# EAGLE design ECLOCK01 (EAGLE 7.3.0)

## Sheet 1 of 2
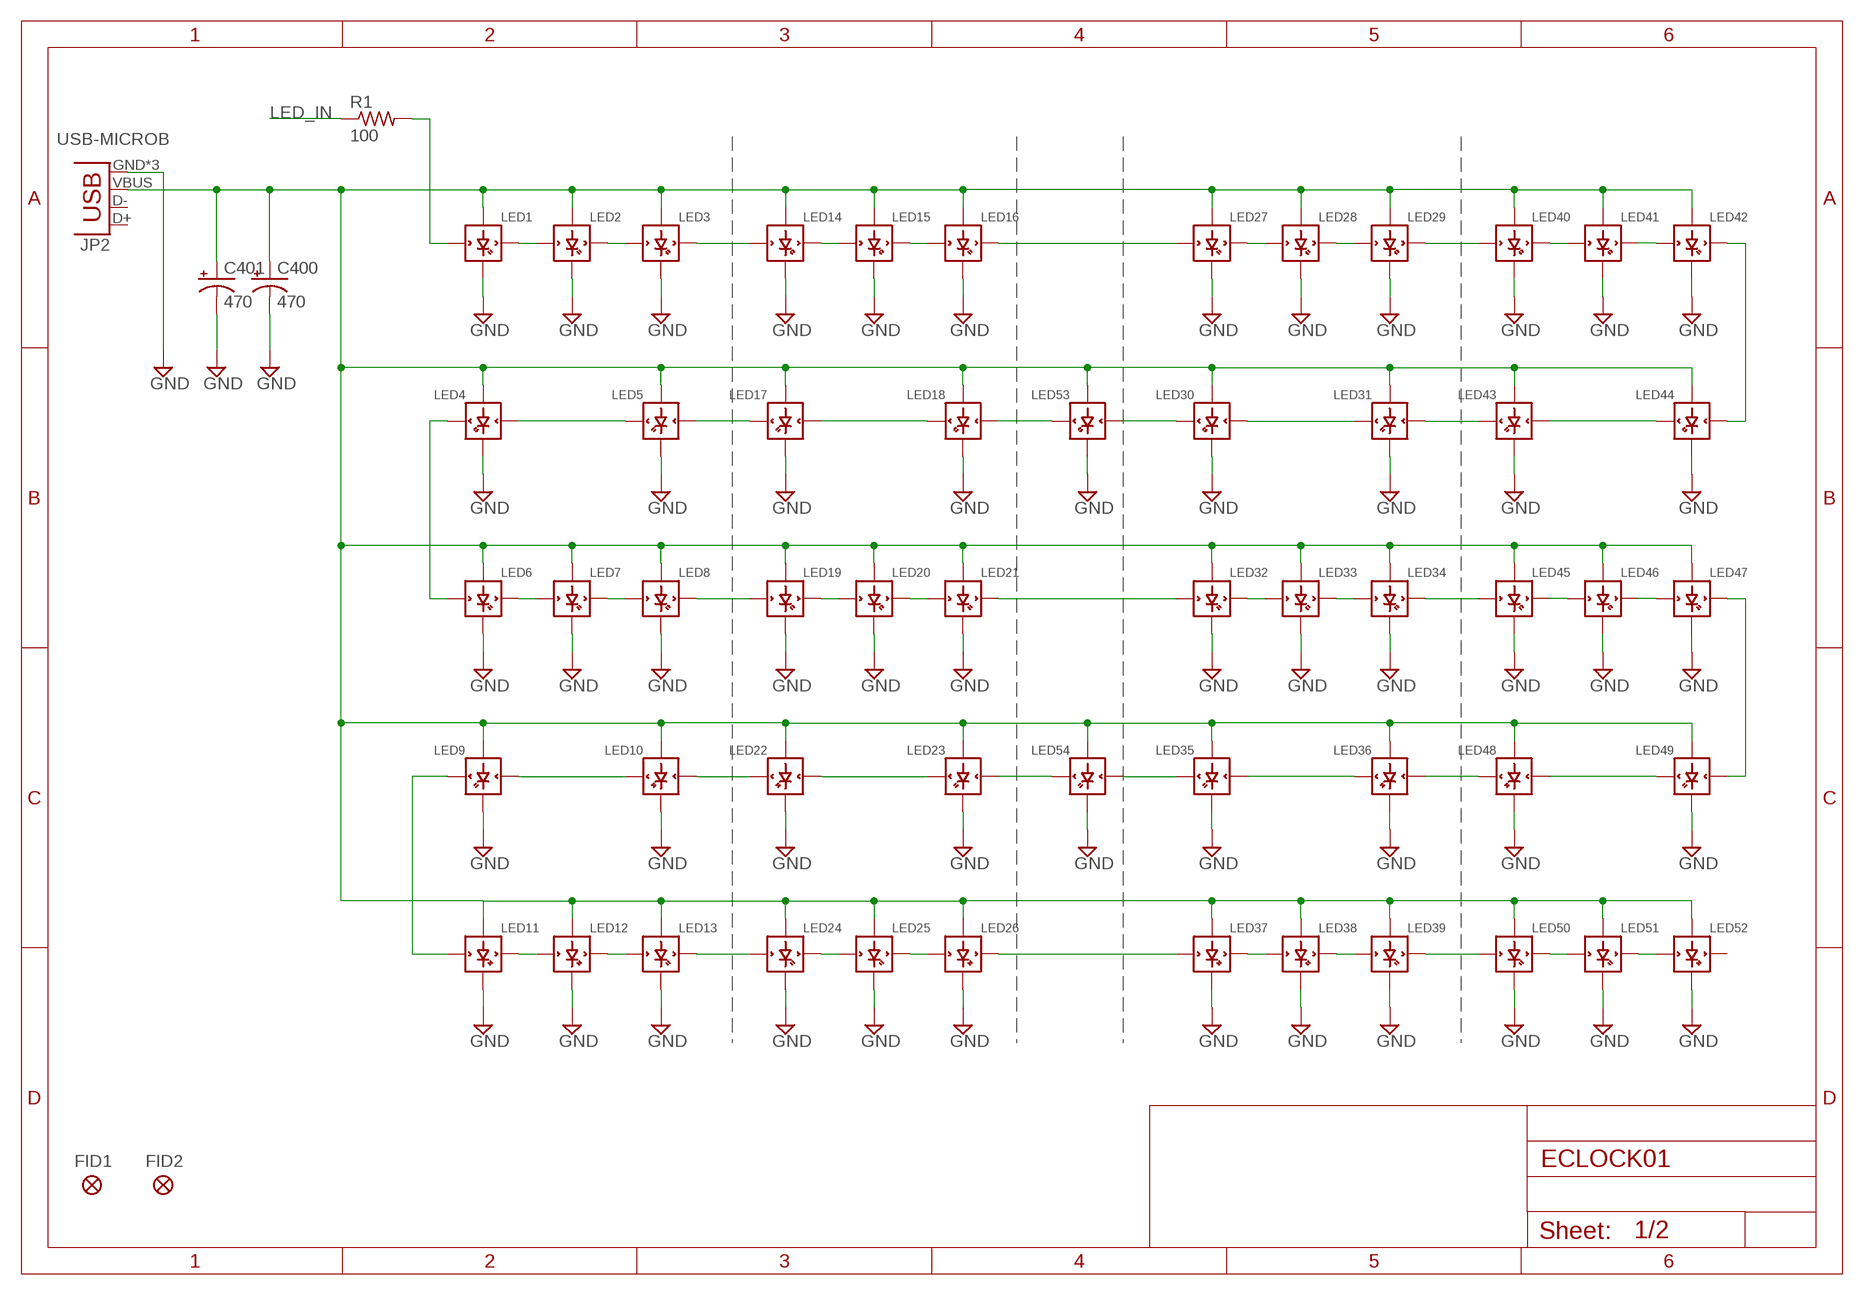
[diagram p0: schematic, sheet 1]

### Parts
C400  470  CPOL-USE  [PANASONIC_E]
C401  470  CPOL-USE  [PANASONIC_E]
FID1  FIDUCIAL  [FIDUCIAL]
FID2  FIDUCIAL  [FIDUCIAL]
JP2  USB-MICROB  [USB-MICROB]
LED1  WS2812B  [WS2812B]
LED2  WS2812B  [WS2812B]
LED3  WS2812B  [WS2812B]
LED4  WS2812B  [WS2812B]
LED5  WS2812B  [WS2812B]
LED6  WS2812B  [WS2812B]
LED7  WS2812B  [WS2812B]
LED8  WS2812B  [WS2812B]
LED9  WS2812B  [WS2812B]
LED10  WS2812B  [WS2812B]
LED11  WS2812B  [WS2812B]
LED12  WS2812B  [WS2812B]
LED13  WS2812B  [WS2812B]
LED14  WS2812B  [WS2812B]
LED15  WS2812B  [WS2812B]
LED16  WS2812B  [WS2812B]
LED17  WS2812B  [WS2812B]
LED18  WS2812B  [WS2812B]
LED19  WS2812B  [WS2812B]
LED20  WS2812B  [WS2812B]
LED21  WS2812B  [WS2812B]
LED22  WS2812B  [WS2812B]
LED23  WS2812B  [WS2812B]
LED24  WS2812B  [WS2812B]
LED25  WS2812B  [WS2812B]
LED26  WS2812B  [WS2812B]
LED27  WS2812B  [WS2812B]
LED28  WS2812B  [WS2812B]
LED29  WS2812B  [WS2812B]
LED30  WS2812B  [WS2812B]
LED31  WS2812B  [WS2812B]
LED32  WS2812B  [WS2812B]
LED33  WS2812B  [WS2812B]
LED34  WS2812B  [WS2812B]
LED35  WS2812B  [WS2812B]
LED36  WS2812B  [WS2812B]
LED37  WS2812B  [WS2812B]
LED38  WS2812B  [WS2812B]
LED39  WS2812B  [WS2812B]
LED40  WS2812B  [WS2812B]
LED41  WS2812B  [WS2812B]
LED42  WS2812B  [WS2812B]
LED43  WS2812B  [WS2812B]
LED44  WS2812B  [WS2812B]
LED45  WS2812B  [WS2812B]
LED46  WS2812B  [WS2812B]
LED47  WS2812B  [WS2812B]
LED48  WS2812B  [WS2812B]
LED49  WS2812B  [WS2812B]
LED50  WS2812B  [WS2812B]
LED51  WS2812B  [WS2812B]
LED52  WS2812B  [WS2812B]
LED53  WS2812B  [WS2812B]
LED54  WS2812B  [WS2812B]
R1  100  RESISTOR0805  [0805]

### Nets
GND: C400.- C401.- JP2.GND JP2.MT1(GND) JP2.MT2(GND) LED1.3-GND(GND) LED2.3-GND(GND) LED3.3-GND(GND) LED4.3-GND(GND) LED5.3-GND(GND) LED6.3-GND(GND) LED7.3-GND(GND) LED8.3-GND(GND) LED9.3-GND(GND) LED10.3-GND(GND) LED11.3-GND(GND) LED12.3-GND(GND) LED13.3-GND(GND) LED14.3-GND(GND) LED15.3-GND(GND) LED16.3-GND(GND) LED17.3-GND(GND) LED18.3-GND(GND) LED19.3-GND(GND) LED20.3-GND(GND) LED21.3-GND(GND) LED22.3-GND(GND) LED23.3-GND(GND) LED24.3-GND(GND) LED25.3-GND(GND) LED26.3-GND(GND) LED27.3-GND(GND) LED28.3-GND(GND) LED29.3-GND(GND) LED30.3-GND(GND) LED31.3-GND(GND) LED32.3-GND(GND) LED33.3-GND(GND) LED34.3-GND(GND) LED35.3-GND(GND) LED36.3-GND(GND) LED37.3-GND(GND) LED38.3-GND(GND) LED39.3-GND(GND) LED40.3-GND(GND) LED41.3-GND(GND) LED42.3-GND(GND) LED43.3-GND(GND) LED44.3-GND(GND) LED45.3-GND(GND) LED46.3-GND(GND) LED47.3-GND(GND) LED48.3-GND(GND) LED49.3-GND(GND) LED50.3-GND(GND) LED51.3-GND(GND) LED52.3-GND(GND) LED53.3-GND(GND) LED54.3-GND(GND) ; also sheet 2
LED_IN: R1.1 ; also sheet 2
N$1: LED1.4-DIN(DIN) R1.2
N$2: LED11.2-DOUT(DOUT) LED12.4-DIN(DIN)
N$3: LED1.2-DOUT(DOUT) LED2.4-DIN(DIN)
N$4: LED2.2-DOUT(DOUT) LED3.4-DIN(DIN)
N$5: LED16.2-DOUT(DOUT) LED27.4-DIN(DIN)
N$7: LED12.2-DOUT(DOUT) LED13.4-DIN(DIN)
N$8: LED26.2-DOUT(DOUT) LED37.4-DIN(DIN)
N$9: LED14.2-DOUT(DOUT) LED15.4-DIN(DIN)
N$10: LED15.2-DOUT(DOUT) LED16.4-DIN(DIN)
N$12: LED18.4-DIN(DIN) LED53.2-DOUT(DOUT)
N$13: LED19.2-DOUT(DOUT) LED20.4-DIN(DIN)
N$14: LED17.4-DIN(DIN) LED18.2-DOUT(DOUT)
N$15: LED8.2-DOUT(DOUT) LED19.4-DIN(DIN)
N$16: LED47.2-DOUT(DOUT) LED49.4-DIN(DIN)
N$17: LED39.2-DOUT(DOUT) LED50.4-DIN(DIN)
N$18: LED24.2-DOUT(DOUT) LED25.4-DIN(DIN)
N$19: LED25.2-DOUT(DOUT) LED26.4-DIN(DIN)
N$20: LED13.2-DOUT(DOUT) LED24.4-DIN(DIN)
N$21: LED27.2-DOUT(DOUT) LED28.4-DIN(DIN)
N$22: LED28.2-DOUT(DOUT) LED29.4-DIN(DIN)
N$25: LED40.2-DOUT(DOUT) LED41.4-DIN(DIN)
N$26: LED20.2-DOUT(DOUT) LED21.4-DIN(DIN)
N$27: LED9.2-DOUT(DOUT) LED11.4-DIN(DIN)
N$28: LED5.4-DIN(DIN) LED17.2-DOUT(DOUT)
N$29: LED4.4-DIN(DIN) LED5.2-DOUT(DOUT)
N$30: LED6.2-DOUT(DOUT) LED7.4-DIN(DIN)
N$31: LED7.2-DOUT(DOUT) LED8.4-DIN(DIN)
N$32: LED21.2-DOUT(DOUT) LED32.4-DIN(DIN)
N$33: LED48.4-DIN(DIN) LED49.2-DOUT(DOUT)
N$34: LED36.4-DIN(DIN) LED48.2-DOUT(DOUT)
N$36: LED37.2-DOUT(DOUT) LED38.4-DIN(DIN)
N$37: LED38.2-DOUT(DOUT) LED39.4-DIN(DIN)
N$39: LED30.2-DOUT(DOUT) LED53.4-DIN(DIN)
N$40: LED34.2-DOUT(DOUT) LED45.4-DIN(DIN)
N$41: LED32.2-DOUT(DOUT) LED33.4-DIN(DIN)
N$42: LED33.2-DOUT(DOUT) LED34.4-DIN(DIN)
N$44: LED31.4-DIN(DIN) LED43.2-DOUT(DOUT)
N$45: LED4.2-DOUT(DOUT) LED6.4-DIN(DIN)
N$46: LED46.2-DOUT(DOUT) LED47.4-DIN(DIN)
N$47: LED45.2-DOUT(DOUT) LED46.4-DIN(DIN)
N$48: LED42.2-DOUT(DOUT) LED44.4-DIN(DIN)
N$49: LED43.4-DIN(DIN) LED44.2-DOUT(DOUT)
N$50: LED30.4-DIN(DIN) LED31.2-DOUT(DOUT)
N$51: LED41.2-DOUT(DOUT) LED42.4-DIN(DIN)
N$52: LED35.4-DIN(DIN) LED36.2-DOUT(DOUT)
N$53: LED35.2-DOUT(DOUT) LED54.4-DIN(DIN)
N$54: LED50.2-DOUT(DOUT) LED51.4-DIN(DIN)
N$55: LED51.2-DOUT(DOUT) LED52.4-DIN(DIN)
N$56: LED23.4-DIN(DIN) LED54.2-DOUT(DOUT)
N$58: LED22.4-DIN(DIN) LED23.2-DOUT(DOUT)
N$59: LED3.2-DOUT(DOUT) LED14.4-DIN(DIN)
N$60: LED10.4-DIN(DIN) LED22.2-DOUT(DOUT)
N$61: LED9.4-DIN(DIN) LED10.2-DOUT(DOUT)
N$62: LED29.2-DOUT(DOUT) LED40.4-DIN(DIN)
VDD: C400.+ C401.+ JP2.VBUS LED1.1-VDD(VDD) LED2.1-VDD(VDD) LED3.1-VDD(VDD) LED4.1-VDD(VDD) LED5.1-VDD(VDD) LED6.1-VDD(VDD) LED7.1-VDD(VDD) LED8.1-VDD(VDD) LED9.1-VDD(VDD) LED10.1-VDD(VDD) LED11.1-VDD(VDD) LED12.1-VDD(VDD) LED13.1-VDD(VDD) LED14.1-VDD(VDD) LED15.1-VDD(VDD) LED16.1-VDD(VDD) LED17.1-VDD(VDD) LED18.1-VDD(VDD) LED19.1-VDD(VDD) LED20.1-VDD(VDD) LED21.1-VDD(VDD) LED22.1-VDD(VDD) LED23.1-VDD(VDD) LED24.1-VDD(VDD) LED25.1-VDD(VDD) LED26.1-VDD(VDD) LED27.1-VDD(VDD) LED28.1-VDD(VDD) LED29.1-VDD(VDD) LED30.1-VDD(VDD) LED31.1-VDD(VDD) LED32.1-VDD(VDD) LED33.1-VDD(VDD) LED34.1-VDD(VDD) LED35.1-VDD(VDD) LED36.1-VDD(VDD) LED37.1-VDD(VDD) LED38.1-VDD(VDD) LED39.1-VDD(VDD) LED40.1-VDD(VDD) LED41.1-VDD(VDD) LED42.1-VDD(VDD) LED43.1-VDD(VDD) LED44.1-VDD(VDD) LED45.1-VDD(VDD) LED46.1-VDD(VDD) LED47.1-VDD(VDD) LED48.1-VDD(VDD) LED49.1-VDD(VDD) LED50.1-VDD(VDD) LED51.1-VDD(VDD) LED52.1-VDD(VDD) LED53.1-VDD(VDD) LED54.1-VDD(VDD) ; also sheet 2
Unconnected: JP2.D+ JP2.D- LED52.2-DOUT(DOUT)

## Sheet 2 of 2
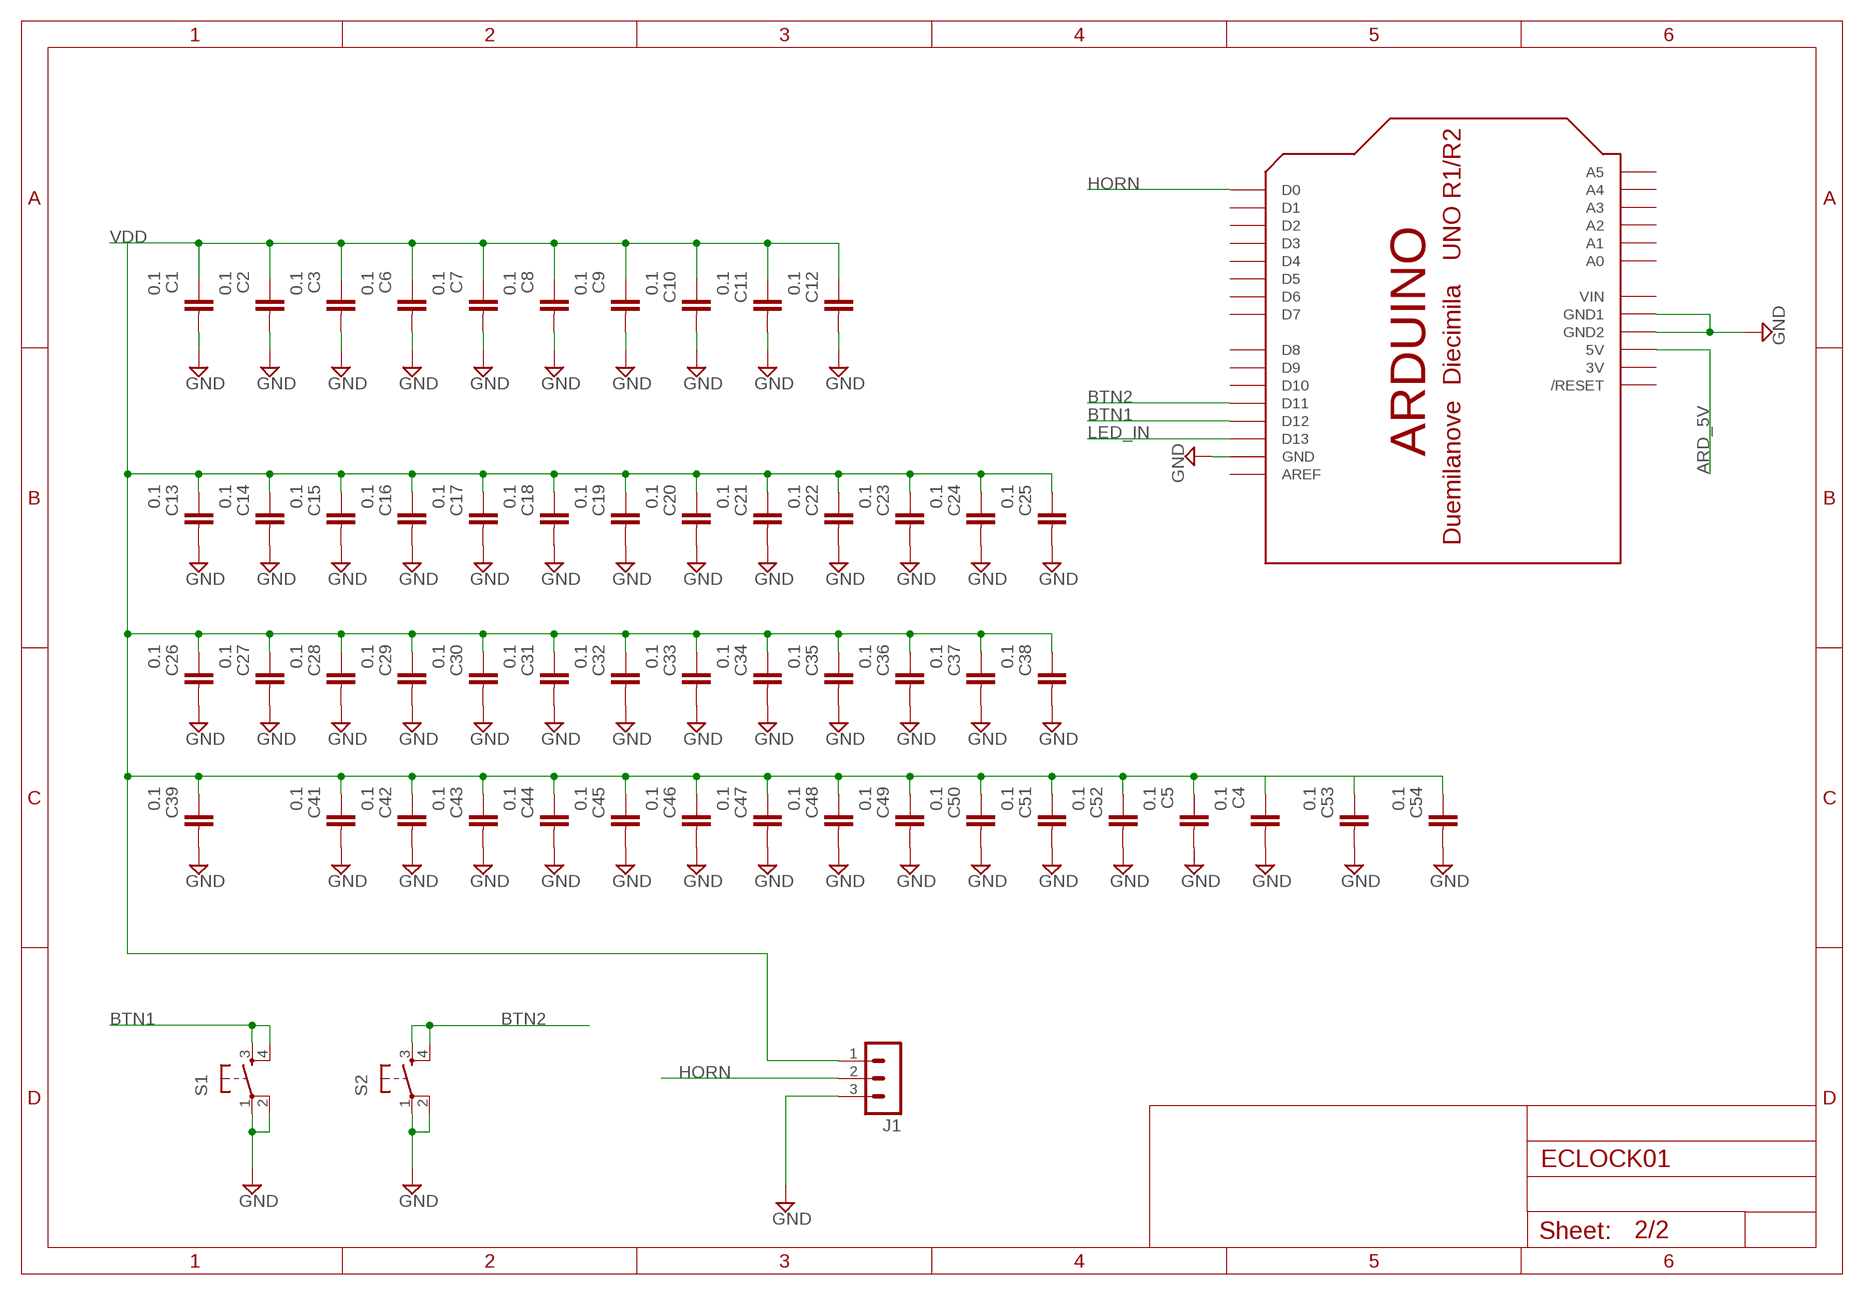
[diagram p1: schematic, sheet 2]

### Parts
C1  0.1  CAPACITOR0805  [0805]
C2  0.1  CAPACITOR0805  [0805]
C3  0.1  CAPACITOR0805  [0805]
C4  0.1  CAPACITOR0805  [0805]
C5  0.1  CAPACITOR0805  [0805]
C6  0.1  CAPACITOR0805  [0805]
C7  0.1  CAPACITOR0805  [0805]
C8  0.1  CAPACITOR0805  [0805]
C9  0.1  CAPACITOR0805  [0805]
C10  0.1  CAPACITOR0805  [0805]
C11  0.1  CAPACITOR0805  [0805]
C12  0.1  CAPACITOR0805  [0805]
C13  0.1  CAPACITOR0805  [0805]
C14  0.1  CAPACITOR0805  [0805]
C15  0.1  CAPACITOR0805  [0805]
C16  0.1  CAPACITOR0805  [0805]
C17  0.1  CAPACITOR0805  [0805]
C18  0.1  CAPACITOR0805  [0805]
C19  0.1  CAPACITOR0805  [0805]
C20  0.1  CAPACITOR0805  [0805]
C21  0.1  CAPACITOR0805  [0805]
C22  0.1  CAPACITOR0805  [0805]
C23  0.1  CAPACITOR0805  [0805]
C24  0.1  CAPACITOR0805  [0805]
C25  0.1  CAPACITOR0805  [0805]
C26  0.1  CAPACITOR0805  [0805]
C27  0.1  CAPACITOR0805  [0805]
C28  0.1  CAPACITOR0805  [0805]
C29  0.1  CAPACITOR0805  [0805]
C30  0.1  CAPACITOR0805  [0805]
C31  0.1  CAPACITOR0805  [0805]
C32  0.1  CAPACITOR0805  [0805]
C33  0.1  CAPACITOR0805  [0805]
C34  0.1  CAPACITOR0805  [0805]
C35  0.1  CAPACITOR0805  [0805]
C36  0.1  CAPACITOR0805  [0805]
C37  0.1  CAPACITOR0805  [0805]
C38  0.1  CAPACITOR0805  [0805]
C39  0.1  CAPACITOR0805  [0805]
C41  0.1  CAPACITOR0805  [0805]
C42  0.1  CAPACITOR0805  [0805]
C43  0.1  CAPACITOR0805  [0805]
C44  0.1  CAPACITOR0805  [0805]
C45  0.1  CAPACITOR0805  [0805]
C46  0.1  CAPACITOR0805  [0805]
C47  0.1  CAPACITOR0805  [0805]
C48  0.1  CAPACITOR0805  [0805]
C49  0.1  CAPACITOR0805  [0805]
C50  0.1  CAPACITOR0805  [0805]
C51  0.1  CAPACITOR0805  [0805]
C52  0.1  CAPACITOR0805  [0805]
C53  0.1  CAPACITOR0805  [0805]
C54  0.1  CAPACITOR0805  [0805]
J1  MA03-1  [MA03-1]
S1  TAC_SWITCHSMD  [TACTILE_SWITCH_SMD]
S2  TAC_SWITCHSMD  [TACTILE_SWITCH_SMD]
U$1  ARDUINOUNO  [ARDUINO-UNO]

### Nets
ARD_5V: U$1.5V
BTN1: S1.3 S1.4 U$1.D12
BTN2: S2.3 S2.4 U$1.D11
GND: C1.2 C2.2 C3.2 C4.2 C5.2 C6.2 C7.2 C8.2 C9.2 C10.2 C11.2 C12.2 C13.2 C14.2 C15.2 C16.2 C17.2 C18.2 C19.2 C20.2 C21.2 C22.2 C23.2 C24.2 C25.2 C26.2 C27.2 C28.2 C29.2 C30.2 C31.2 C32.2 C33.2 C34.2 C35.2 C36.2 C37.2 C38.2 C39.2 C41.2 C42.2 C43.2 C44.2 C45.2 C46.2 C47.2 C48.2 C49.2 C50.2 C51.2 C52.2 C53.2 C54.2 J1.3 S1.1 S1.2 S2.1 S2.2 U$1.GND U$1.GND1 U$1.GND2 ; also sheet 1
HORN: J1.2 U$1.D0
LED_IN: U$1.D13 ; also sheet 1
VDD: C1.1 C2.1 C3.1 C4.1 C5.1 C6.1 C7.1 C8.1 C9.1 C10.1 C11.1 C12.1 C13.1 C14.1 C15.1 C16.1 C17.1 C18.1 C19.1 C20.1 C21.1 C22.1 C23.1 C24.1 C25.1 C26.1 C27.1 C28.1 C29.1 C30.1 C31.1 C32.1 C33.1 C34.1 C35.1 C36.1 C37.1 C38.1 C39.1 C41.1 C42.1 C43.1 C44.1 C45.1 C46.1 C47.1 C48.1 C49.1 C50.1 C51.1 C52.1 C53.1 C54.1 J1.1 ; also sheet 1
Unconnected: U$1.A0 U$1.A1 U$1.A2 U$1.A3 U$1.A4 U$1.A5 U$1.AREF U$1.D1 U$1.D2 U$1.D3 U$1.D4 U$1.D5 U$1.D6 U$1.D7 U$1.D8 U$1.D9 U$1.D10 U$1.RESET(/RESET)

## Power pins joined to a net without a drawn wire
3V: U$1.3V
VIN: U$1.VIN

## Library data of the parts
C1-C39 C41-C54 = TinWhiskers:CAPACITOR
C400 C401 = adafruit:CPOL-US: POLARIZED CAPACITOR, American symbol
FID1 FID2 = TinWhiskers:FIDUCIAL
J1 = !con-lstb:MA03-1: PIN HEADER
JP2 = SparkFun-Connectors:USB: USB Connectors USB-B-PTH is fully proven SKU : PRT-00139/CONN-08278 USB-miniB is fully proven SKU : PRT-00587 USB-A-PCB is untested. USB-A-H is throughly reviewed, but untested. Spark Fun Electronics SKU : PRT-00437 USB-B-SMT is throughly reviewed, but untested. Needs silkscreen touching up. USB-A-S has not been used/tested USB-MB-H has not been used/tested USB-MICROB has been used. CONN-09505; PROD_ID: CONN-09505
LED1-LED54 = GinWhiskers - temp stuff:WS2812B
R1 = TinWhiskers:RESISTOR
S1 S2 = SparkFun:TAC_SWITCH: Momentary Switch Button commonly used for reset or general input. Spark Fun Electronics SKU : COM-00097
U$1 = GinWhiskers - temp stuff:ARDUINO

## Net classes
0 default: width 0.152 mm, drill 0.305 mm, clearance 0.152 mm

## Board
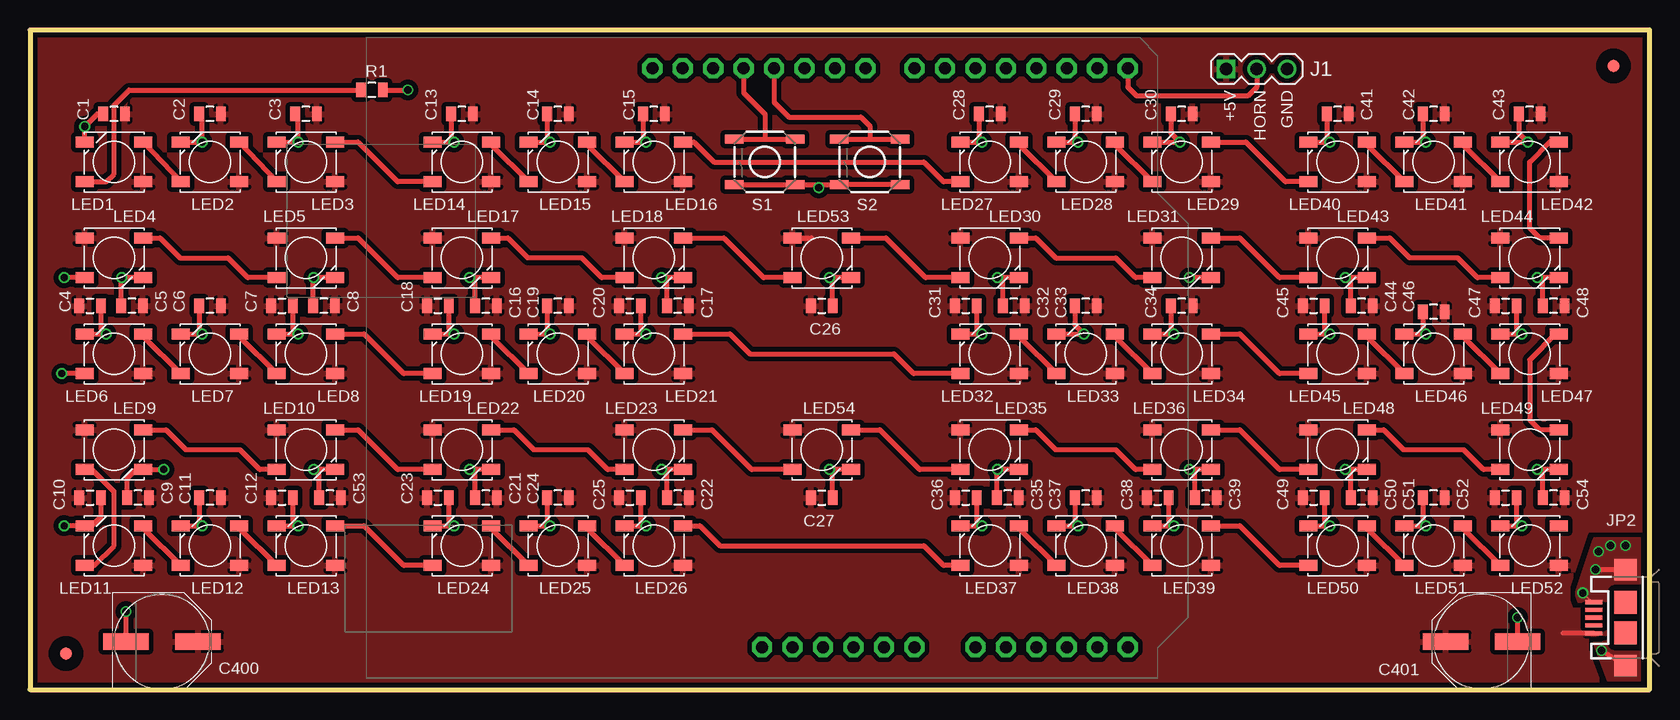
[diagram p2: board, top side]
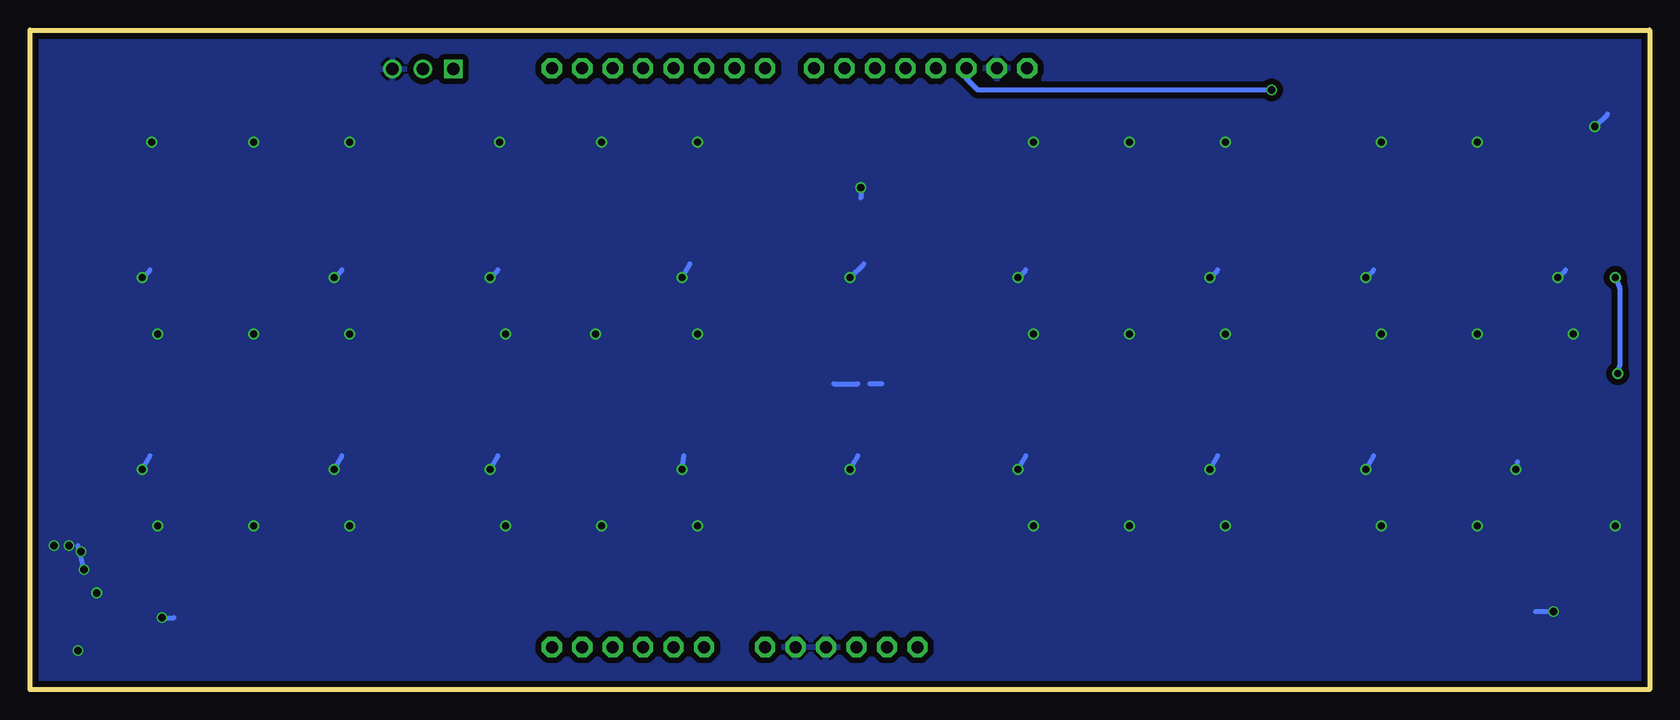
[diagram p3: board, bottom side, seen from below]

Size 135 x 55 mm. Coordinates in mm from the lower left corner, seen from the top.
Outline: 0,0 135,0 135,55 0,55 0,0
Copper layers (1*16): Top 0.035mm / dielectric 1.5mm / Bottom 0.035mm
Design rules "SeeedStudio_2layer_DRU_no_angle_20140221": minimum track width 6mil, minimum drill 12mil, track to track 6mil, track to pad 6mil, pad to pad 6mil, via to via 6mil, smd to smd 0mil, copper to edge 10mil, drill to drill 10mil, minimum pad ring 10mil, minimum via ring 6mil, stop-mask expansion 2mil, vias tented up to drill 100mil, thermal gap 10mil

### Footprints (pad centres in the part's own frame; a part is rotated, then mirrored left to right if it is on the bottom)
0805 = smd 0.8 x 1.2: 1 -0.9,0; 2 0.9,0
PANASONIC_E = smd 3.8 x 1.4: + 3,0; - -3,0
FIDUCIAL = smd 1 x 1: 1 0,0
MA03-1 = drill 1.016 square: 1 -2.54,0 | drill 1.016: 2 0,0; 3 2.54,0
USB-MICROB = smd 0.35 x 1.4: D+ 0,2.65; D- -0.65,2.65; GND 1.3,2.65; ID 0.65,2.65; VBUS -1.3,2.65 | smd 1.8 x 1.9: MT1 -4,0; MT2 4,0 | smd 1.9 x 1.9: P$1 -1.27,0; P$2 1.27,0
WS2812B = smd 1.5 x 0.9: 1-VDD 2.45,-1.65; 2-DOUT 2.45,1.65; 3-GND -2.45,1.65; 4-DIN -2.45,-1.65
TACTILE_SWITCH_SMD = smd 1.524 x 0.762: 1 -2.54,1.905; 2 2.54,1.905; 3 -2.54,-1.905; 4 2.54,-1.905
ARDUINO-UNO = drill 1 pad 1.676 octagon: 3V 35.56,2.54; 5V 38.1,2.54; A0 50.8,2.54; A1 53.34,2.54; A2 55.88,2.54; A3 58.42,2.54; A4 60.96,2.54; A5 63.5,2.54; AREF 23.876,50.8; D0 63.5,50.8; D1 60.96,50.8; D2 58.42,50.8; D3 55.88,50.8; D4 53.34,50.8; D5 50.8,50.8; D6 48.26,50.8; D7 45.72,50.8; D8 41.656,50.8; D9 39.116,50.8; D10 36.576,50.8; D11 34.036,50.8; D12 31.496,50.8; D13 28.956,50.8; GND 26.416,50.8; GND1 43.18,2.54; GND2 40.64,2.54; RESET 33.02,2.54; VIN 45.72,2.54

### Placement (x,y rotation side)
C1  7,48 180 top
C2  15,48 180 top
C3  23,48 180 top
C4  5,32 0 top
C5  8.5,32 180 top
C6  15,32 180 top
C7  21,32 0 top
C8  24.5,32 180 top
C9  9,16 180 top
C10  5,16 0 top
C11  15,16 180 top
C12  21,16 0 top
C13  36,48 180 top
C14  44,48 180 top
C15  52,48 180 top
C16  38,32 180 top
C17  54,32 180 top
C18  34,32 0 top
C19  44,32 180 top
C20  50,32 0 top
C21  38,16 180 top
C22  54,16 180 top
C23  34,16 0 top
C24  44,16 180 top
C25  50,16 0 top
C26  66,32 0 top
C27  66,16 0 top
C28  80,48 180 top
C29  88,48 180 top
C30  96,48 180 top
C31  78,32 0 top
C32  82,32 180 top
C33  88,32 180 top
C34  96,32 180 top
C35  81.5,16 180 top
C36  78,16 0 top
C37  88,16 180 top
C38  94,16 0 top
C39  98,16 180 top
C41  109,48 180 top
C42  117,48 180 top
C43  125,48 180 top
C44  111,32 180 top
C45  107,32 0 top
C46  117,31.5 180 top
C47  123,32 0 top
C48  127,32 180 top
C49  107,16 0 top
C50  111,16 180 top
C51  117,16 180 top
C52  123,16 0 top
C53  25,16 180 top
C54  127,16 180 top
C400  11,4 0 top
C401  121,4 180 top
FID1  3,3 0 top
FID2  132,52 0 top
J1  102.25,51.75 0 top
JP2  133,6 90 top
LED1  7,44 0 top
LED2  15,44 0 top
LED3  23,44 0 top
LED4  7,36 180 top
LED5  23,36 180 top
LED6  7,28 0 top
LED7  15,28 0 top
LED8  23,28 0 top
LED9  7,20 180 top
LED10  23,20 180 top
LED11  7,12 0 top
LED12  15,12 0 top
LED13  23,12 0 top
LED14  36,44 0 top
LED15  44,44 0 top
LED16  52,44 0 top
LED17  36,36 180 top
LED18  52,36 180 top
LED19  36,28 0 top
LED20  44,28 0 top
LED21  52,28 0 top
LED22  36,20 180 top
LED23  52,20 180 top
LED24  36,12 0 top
LED25  44,12 0 top
LED26  52,12 0 top
LED27  80,44 0 top
LED28  88,44 0 top
LED29  96,44 0 top
LED30  80,36 180 top
LED31  96,36 180 top
LED32  80,28 0 top
LED33  88,28 0 top
LED34  96,28 0 top
LED35  80,20 180 top
LED36  96,20 180 top
LED37  80,12 0 top
LED38  88,12 0 top
LED39  96,12 0 top
LED40  109,44 0 top
LED41  117,44 0 top
LED42  125,44 0 top
LED43  109,36 180 top
LED44  125,36 180 top
LED45  109,28 0 top
LED46  117,28 0 top
LED47  125,28 0 top
LED48  109,20 180 top
LED49  125,20 180 top
LED50  109,12 0 top
LED51  117,12 0 top
LED52  125,12 0 top
LED53  66,36 180 top
LED54  66,20 180 top
R1  28.5,50 180 top
S1  61.25,44 180 top
S2  70,44 180 top
U$1  28,1 0 top

### Tracks (layer width: path | path; a pad name or v marks a point on that pad's centre or on a via)
BTN1
  Top 0.406: S1.4 61.25,45.91 | 61.25,45.91 S1.3 | U$1.D12 59.5,49.75 61.25,48 61.25,45.91
BTN2
  Top 0.406: S2.4 70,45.91 | 70,45.91 S2.3 | U$1.D11 62.04,48.96 63.25,47.75 69.25,47.75 70,47 70,45.91
GND  (via drill 0.6)
  Top 0.2: JP2.GND 130.2,7.3 v129.45,8.05
  Top 0.406: LED26.3-GND v51.35,13.65 50.9,14.1 C25.2 | LED24.3-GND v35.35,13.65 34.9,14.1 C23.2 | LED25.3-GND v43.35,13.65 43.1,13.9 C24.2 | LED13.3-GND v22.35,13.65 21.9,14.1 C12.2 | LED12.3-GND v14.35,13.65 14.1,13.9 C11.2 | v2.85,13.65 LED11.3-GND 5.15,13.65 5.9,14.4 C10.2 | LED19.3-GND v35.35,29.65 34.9,30.1 C18.2 | LED20.3-GND v43.35,29.65 43.1,29.9 C19.2 | LED21.3-GND v51.35,29.65 | LED6.3-GND v6.35,29.65 5.9,30.1 C4.2 | LED7.3-GND v14.35,29.65 14.1,29.9 C6.2 | LED8.3-GND v22.35,29.65 21.9,30.1 C7.2 | LED2.3-GND v14.35,45.65 14.35,47.75 C2.2 | LED3.3-GND v22.35,45.65 22.35,47.75 C3.2 | LED16.3-GND v51.35,45.65 51.1,45.9 C15.2 | LED15.3-GND v43.35,45.65 43.1,45.9 C14.2 | LED14.3-GND v35.35,45.65 35.1,45.9 C13.2 | LED27.3-GND v79.35,45.65 79.1,45.9 C28.2 | LED28.3-GND v87.35,45.65 87.1,45.9 C29.2 | LED29.3-GND v95.85,45.65 95.1,46.4 C30.2 | LED40.3-GND v108.35,45.65 108.1,45.9 C41.2 | LED41.3-GND v116.35,45.65 116.1,45.9 C42.2 | LED42.3-GND v124.85,45.65 124.1,46.4 C43.2 | LED45.3-GND v108.35,29.65 107.9,30.1 C45.2 | LED46.3-GND v116.35,29.65 116.1,29.9 C46.2 | LED47.3-GND v124.35,29.65 123.9,30.1 C47.2 | LED52.3-GND v124.35,13.65 123.9,14.1 C52.2 | LED51.3-GND v116.35,13.65 116.1,13.9 C51.2 | LED50.3-GND v108.35,13.65 107.9,14.1 C49.2 | LED39.3-GND v95.35,13.65 94.9,14.1 C38.2 | LED38.3-GND v87.35,13.65 87.1,13.9 C37.2 | LED37.3-GND v79.35,13.65 78.9,14.1 C36.2 | LED34.3-GND v95.35,29.65 95.1,29.9 C34.2 | LED33.3-GND v87.85,29.65 87.1,30.4 C33.2 | LED32.3-GND v79.35,29.65 78.9,30.1 C31.2 | LED4.3-GND v7.65,34.35 7.6,34.3 C5.2 | LED5.3-GND v23.65,34.35 23.6,34.3 C8.2 | LED17.3-GND v36.65,34.35 37.1,33.9 C16.2
  Top 0.406: LED18.3-GND v52.65,34.35 53.1,33.9 C17.2 | LED30.3-GND v80.65,34.35 81.1,33.9 C32.2 | LED31.3-GND v96.65,34.35 | LED43.3-GND v109.65,34.35 110.1,33.9 C44.2 | LED44.3-GND v125.65,34.35 126.1,33.9 C48.2 | v11.15,18.35 LED9.3-GND 8.85,18.35 8.1,17.6 C9.2 | LED10.3-GND v23.65,18.35 24.1,17.9 C53.2 | LED22.3-GND v36.65,18.35 37.1,17.9 C21.2 | LED23.3-GND v52.65,18.35 53.1,17.9 C22.2 | LED54.3-GND v66.65,18.35 66.9,18.1 C27.2 | LED35.3-GND v80.65,18.35 80.6,18.3 C35.2 | LED36.3-GND v96.65,18.35 97.1,17.9 C39.2 | LED48.3-GND v109.65,18.35 110.1,17.9 C50.2 | LED49.3-GND v125.65,18.35 126.1,17.9 C54.2 | LED53.3-GND v66.65,34.35 66.9,34.1 C26.2 | JP2.MT2 v130.5,10 | JP2.MT1 v131,3.25 | C401.- v124,6 | C400.- v8,6.5 | 51.4,29.7 v51.35,29.65 | C20.2 50.9,30.1 v51.35,29.65 | LED1.3-GND v4.55,46.95 5.6,48 C1.2 | S1.2 S1.1 65.75,42.09 | S2.1 S2.2 65.75,42.09 | v65.75,41.84 65.75,42.09
  Bottom 0.406: v7.65,34.35 7,35 | v23.65,34.35 23,35 | v36.65,34.35 36,35 | v52.65,34.35 52,35 | v80.65,34.35 80,35.5 | v96.65,34.35 96,35 | v109.65,34.35 109,35 | v125.65,34.35 125,35 | v11.15,18.35 11,19 | v23.65,18.35 23,19.5 | v36.65,18.35 36,19.5 | v52.65,18.35 52,19.5 | v66.65,18.35 66,19.5 | v80.65,18.35 80.5,19.5 | v96.65,18.35 96,19.5 | v109.65,18.35 109,19.5 | v125.65,18.35 125,19.5 | v66.65,34.35 65.5,35.5 | 64,25.5 65,25.5 | 68,25.5 66,25.5 | v130.5,10 131,12 | v124,6 123,6 | v8,6.5 9.5,6.5 | v4.55,46.95 3.5,48 | v65.75,41.84 65.75,41
  other vias: 130.75,11.5 133,12 131.75,12
  pour Bottom (isolate 0.5): 0,0 135,0 135,55 0,55
  pour Top (isolate 0.5, no thermals): 135,12.5 135,0 132,0 129,8 130.5,12.5
HORN
  Top 0.406: J1.2 102.25,50.25 101.5,49.5 92.25,49.5 91.5,50.25 U$1.D0
LED_IN  (via drill 0.6)
  Top 0.406: R1.1 v31.5,50
  Bottom 0.406: v31.5,50 56,50 56.96,50.96 U$1.D13
N$1
  Top 0.406: LED1.4-DIN 6.35,42.35 7,43 7,48.75 8.25,50 R1.2
N$2
  Top 0.406: LED11.2-DOUT 9.45,13.45 LED12.4-DIN
N$3
  Top 0.406: LED1.2-DOUT LED2.4-DIN
N$4
  Top 0.406: LED2.2-DOUT LED3.4-DIN
N$5
  Top 0.406: LED16.2-DOUT 55.35,45.65 57,44 74.5,44 76.15,42.35 LED27.4-DIN
N$7
  Top 0.406: LED12.2-DOUT 17.45,13.45 LED13.4-DIN
N$8
  Top 0.406: LED26.2-DOUT 55.85,13.65 57.5,12 74.5,12 76.15,10.35 LED37.4-DIN
N$9
  Top 0.406: LED14.2-DOUT 38.45,45.45 LED15.4-DIN
N$10
  Top 0.406: LED15.2-DOUT 46.45,45.45 LED16.4-DIN
N$12
  Top 0.406: LED53.2-DOUT 61.15,34.35 57.85,37.65 LED18.4-DIN
N$13
  Top 0.406: LED19.2-DOUT 38.45,29.45 LED20.4-DIN
N$14
  Top 0.406: LED18.2-DOUT 47.65,34.35 46,36 41.5,36 39.85,37.65 LED17.4-DIN
N$15
  Top 0.406: LED8.2-DOUT 27.85,29.65 31.15,26.35 LED19.4-DIN
N$16
  Top 0.406: LED47.2-DOUT 127.15,29.65 125,27.5 125,22.5 125.85,21.65 LED49.4-DIN
N$17
  Top 0.406: LED39.2-DOUT 100.85,13.65 104.15,10.35 LED50.4-DIN
N$18
  Top 0.406: LED24.2-DOUT 38.45,13.45 LED25.4-DIN
N$19
  Top 0.406: LED25.2-DOUT 46.45,13.45 LED26.4-DIN
N$20
  Top 0.406: LED13.2-DOUT 27.85,13.65 31.15,10.35 LED24.4-DIN
N$21
  Top 0.406: LED27.2-DOUT 82.45,45.45 LED28.4-DIN
N$22
  Top 0.406: LED28.2-DOUT 90.45,45.45 LED29.4-DIN
N$25
  Top 0.406: LED40.2-DOUT 111.45,45.45 LED41.4-DIN
N$26
  Top 0.406: LED20.2-DOUT 46.45,29.45 LED21.4-DIN
N$27
  Top 0.406: LED11.4-DIN 5.35,10.35 7,12 7,16.5 5.15,18.35 LED9.2-DOUT
N$28
  Top 0.406: LED5.4-DIN 27.35,37.65 30.65,34.35 LED17.2-DOUT
N$29
  Top 0.406: LED4.4-DIN 10.85,37.65 12.5,36 16.5,36 18.15,34.35 LED5.2-DOUT
N$30
  Top 0.406: LED6.2-DOUT 9.45,29.45 LED7.4-DIN
N$31
  Top 0.406: LED7.2-DOUT 17.45,29.45 LED8.4-DIN
N$32
  Top 0.406: LED21.2-DOUT 58.35,29.65 60,28 72,28 73.65,26.35 LED32.4-DIN
N$33
  Top 0.406: LED49.2-DOUT 121.15,18.35 119.5,20 114.5,20 112.85,21.65 LED48.4-DIN
N$34
  Top 0.406: LED36.4-DIN 100.85,21.65 104.15,18.35 LED48.2-DOUT
N$36
  Top 0.406: LED37.2-DOUT 82.45,13.45 LED38.4-DIN
N$37
  Top 0.406: LED38.2-DOUT 90.45,13.45 LED39.4-DIN
N$39
  Top 0.406: LED53.4-DIN 71.35,37.65 74.65,34.35 LED30.2-DOUT
N$40
  Top 0.406: LED34.2-DOUT 100.85,29.65 104.15,26.35 LED45.4-DIN
N$41
  Top 0.406: LED32.2-DOUT 82.45,29.45 LED33.4-DIN
N$42
  Top 0.406: LED33.2-DOUT 90.45,29.45 LED34.4-DIN
N$44
  Top 0.406: LED31.4-DIN 100.85,37.65 104.15,34.35 LED43.2-DOUT
N$45  (via drill 0.6)
  Top 0.406: LED4.2-DOUT v2.85,34.35 | LED6.4-DIN v2.65,26.35
  Bottom 0.406: v2.85,34.35 2.5,33.5 2.5,27 v2.65,26.35
N$46
  Top 0.406: LED46.2-DOUT 119.45,29.45 LED47.4-DIN
N$47
  Top 0.406: LED45.2-DOUT 111.45,29.45 LED46.4-DIN
N$48
  Top 0.406: LED42.2-DOUT 126.65,45.65 125,44 125,38.5 125.85,37.65 LED44.4-DIN
N$49
  Top 0.406: LED44.2-DOUT 120.65,34.35 119,36 115,36 113.35,37.65 LED43.4-DIN
N$50
  Top 0.406: LED30.4-DIN 83.85,37.65 85.5,36 90.5,36 92.15,34.35 LED31.2-DOUT
N$51
  Top 0.406: LED41.2-DOUT 119.45,45.45 LED42.4-DIN
N$52
  Top 0.406: LED36.2-DOUT 92.15,18.35 90.5,20 85.5,20 83.85,21.65 LED35.4-DIN
N$53
  Top 0.406: LED54.4-DIN 70.85,21.65 74.15,18.35 LED35.2-DOUT
N$54
  Top 0.406: LED50.2-DOUT 111.45,13.45 LED51.4-DIN
N$55
  Top 0.406: LED51.2-DOUT 119.45,13.45 LED52.4-DIN
N$56
  Top 0.406: LED23.4-DIN 56.85,21.65 60.15,18.35 LED54.2-DOUT
N$58
  Top 0.406: LED23.2-DOUT 48.15,18.35 46.5,20 42,20 40.35,21.65 LED22.4-DIN
N$59
  Top 0.406: LED3.2-DOUT 27.35,45.65 30.65,42.35 LED14.4-DIN
N$60
  Top 0.406: LED10.4-DIN 27.35,21.65 30.65,18.35 LED22.2-DOUT
N$61
  Top 0.406: LED10.2-DOUT 19.15,18.35 17.5,20 13,20 11.35,21.65 LED9.4-DIN
N$62
  Top 0.406: LED29.2-DOUT 101.35,45.65 104.65,42.35 LED40.4-DIN
VDD
  Top 0.406: JP2.VBUS 127.8,4.7 | LED53.1-VDD 65.15,37.65
  pour Top (isolate 0.4, rank 2): 0,55 135,55 135,0 0,0

### Text on the board
tPlace: +5V | HORN | GND